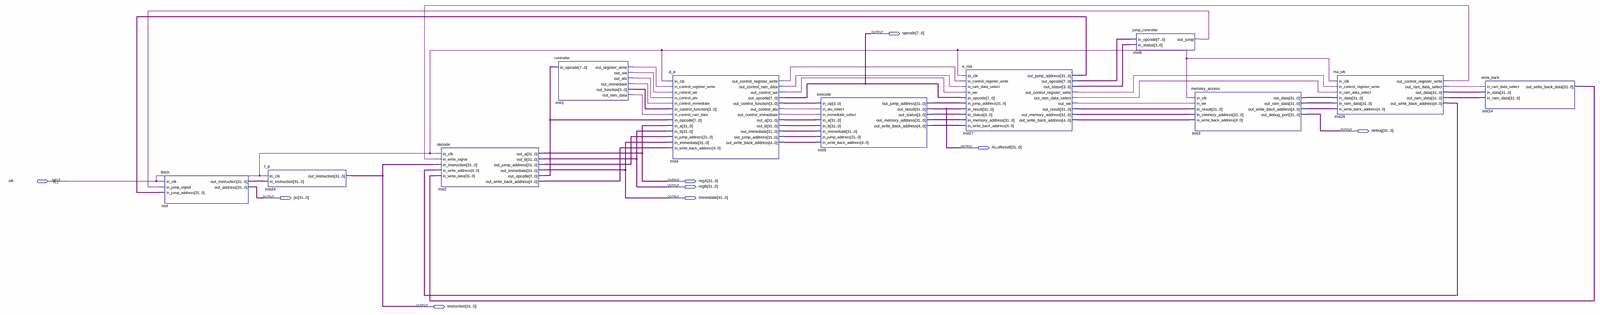
[diagram p0: schematic sheet, whole]
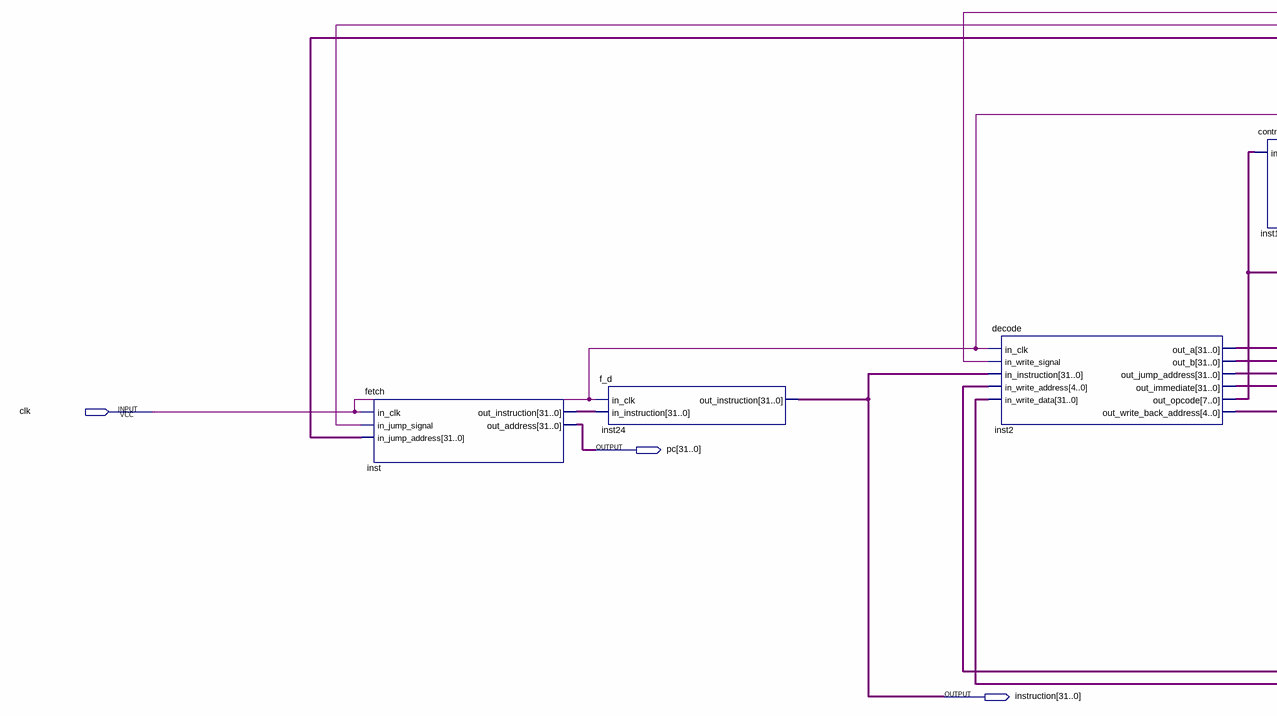
[diagram p1: schematic sheet, left part]
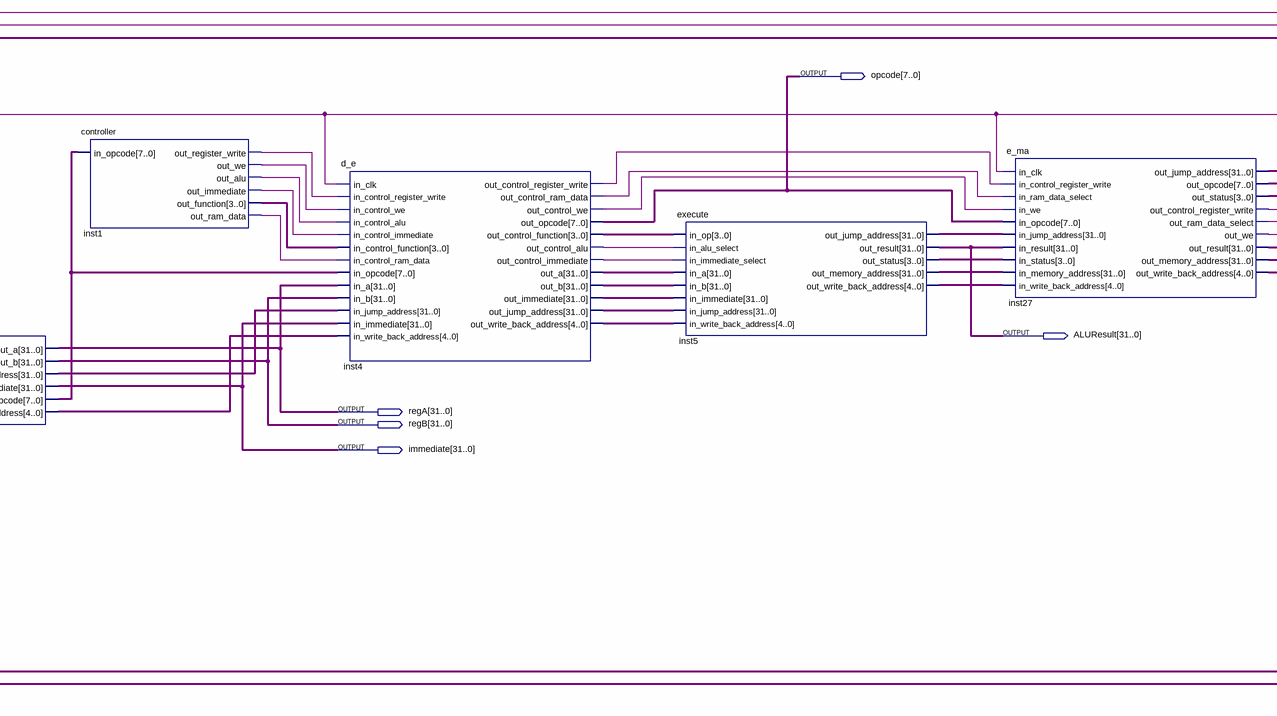
[diagram p2: schematic sheet, centre part]
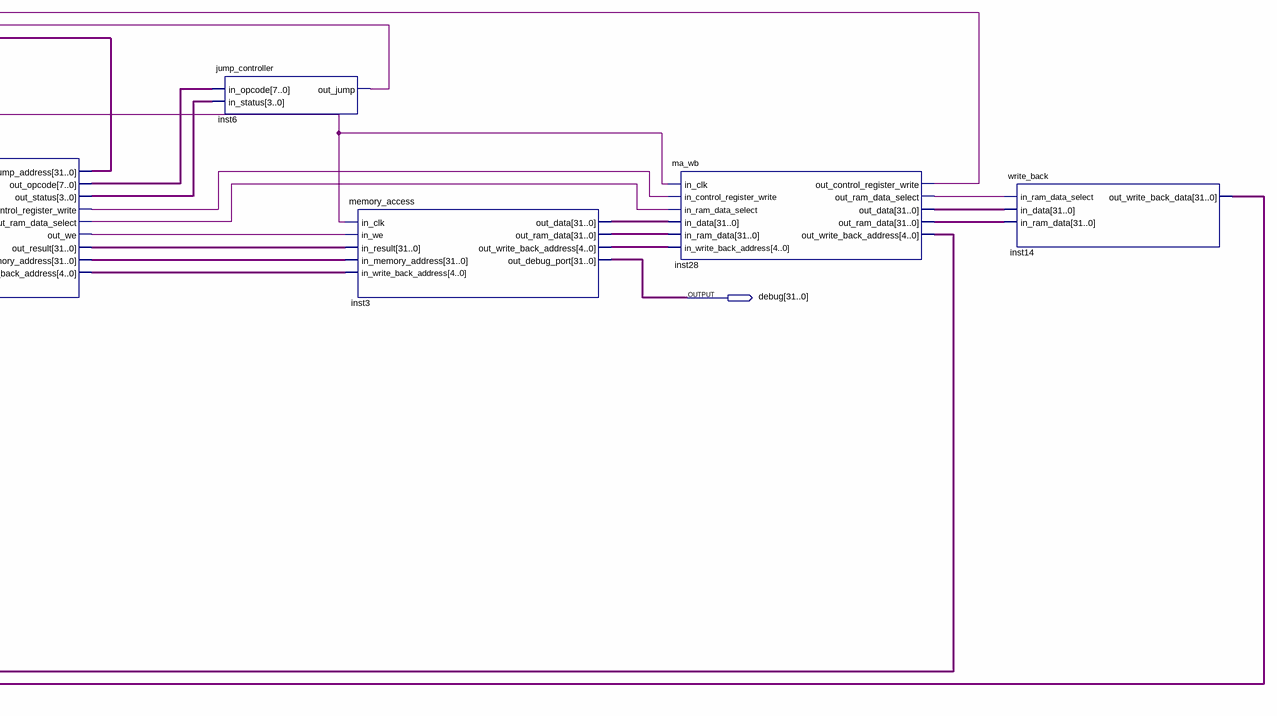
[diagram p3: schematic sheet, right part]
// Quartus schematic Processor.bdf as structural Verilog: 11 symbols, 9 pins
module Processor (
  input  clk,
  output [7:0] opcode,
  output [31:0] debug,
  output [31:0] ALUResult,
  output [31:0] regA,
  output [31:0] regB,
  output [31:0] pc,
  output [31:0] immediate,
  output [31:0] instruction
);

  wire inst1_out_alu, inst1_out_immediate, inst1_out_ram_data, inst1_out_register_write, inst1_out_we,
       inst4_out_control_alu, inst4_out_control_immediate, inst4_out_control_ram_data,
       inst4_out_control_register_write, inst4_out_control_we, inst6_out_jump,
       inst27_out_control_register_write, inst27_out_ram_data_select, inst27_out_we,
       inst28_out_control_register_write, inst28_out_ram_data_select;
  wire [3:0] inst1_out_function, inst4_out_control_function, inst5_out_status, inst27_out_status;
  wire [4:0] inst2_out_write_back_address, inst3_out_write_back_address, inst4_out_write_back_address,
       inst5_out_write_back_address, inst27_out_write_back_address, inst28_out_write_back_address;
  wire [7:0] inst2_out_opcode, inst27_out_opcode;
  wire [31:0] inst2_out_jump_address, inst3_out_data, inst3_out_ram_data, inst4_out_a, inst4_out_b,
       inst4_out_immediate, inst4_out_jump_address, inst5_out_jump_address, inst5_out_memory_address,
       inst14_out_write_back_data, inst27_out_jump_address, inst27_out_memory_address, inst27_out_result,
       inst28_out_data, inst28_out_ram_data, inst_out_instruction;

  fetch inst (
    .in_clk(clk), .in_jump_signal(inst6_out_jump), .in_jump_address(inst27_out_jump_address),
    .out_instruction(inst_out_instruction), .out_address(pc));
  f_d inst24 (.in_clk(clk), .in_instruction(inst_out_instruction), .out_instruction(instruction));
  decode inst2 (
    .in_clk(clk), .in_write_signal(inst28_out_control_register_write), .in_instruction(instruction),
    .in_write_address(inst28_out_write_back_address), .in_write_data(inst14_out_write_back_data),
    .out_a(regA), .out_b(regB), .out_jump_address(inst2_out_jump_address), .out_immediate(immediate),
    .out_opcode(inst2_out_opcode), .out_write_back_address(inst2_out_write_back_address));
  controller inst1 (
    .in_opcode(inst2_out_opcode), .out_register_write(inst1_out_register_write), .out_we(inst1_out_we),
    .out_alu(inst1_out_alu), .out_immediate(inst1_out_immediate), .out_function(inst1_out_function),
    .out_ram_data(inst1_out_ram_data));
  d_e inst4 (
    .in_clk(clk), .in_control_register_write(inst1_out_register_write), .in_control_we(inst1_out_we),
    .in_control_alu(inst1_out_alu), .in_control_immediate(inst1_out_immediate),
    .in_control_function(inst1_out_function), .in_control_ram_data(inst1_out_ram_data),
    .in_opcode(inst2_out_opcode), .in_a(regA), .in_b(regB), .in_jump_address(inst2_out_jump_address),
    .in_immediate(immediate), .in_write_back_address(inst2_out_write_back_address),
    .out_control_register_write(inst4_out_control_register_write),
    .out_control_ram_data(inst4_out_control_ram_data), .out_control_we(inst4_out_control_we),
    .out_opcode(opcode), .out_control_function(inst4_out_control_function),
    .out_control_alu(inst4_out_control_alu), .out_control_immediate(inst4_out_control_immediate),
    .out_a(inst4_out_a), .out_b(inst4_out_b), .out_immediate(inst4_out_immediate),
    .out_jump_address(inst4_out_jump_address), .out_write_back_address(inst4_out_write_back_address));
  execute inst5 (
    .in_op(inst4_out_control_function), .in_alu_select(inst4_out_control_alu),
    .in_immediate_select(inst4_out_control_immediate), .in_a(inst4_out_a), .in_b(inst4_out_b),
    .in_immediate(inst4_out_immediate), .in_jump_address(inst4_out_jump_address),
    .in_write_back_address(inst4_out_write_back_address), .out_jump_address(inst5_out_jump_address),
    .out_result(ALUResult), .out_status(inst5_out_status), .out_memory_address(inst5_out_memory_address),
    .out_write_back_address(inst5_out_write_back_address));
  e_ma inst27 (
    .in_clk(clk), .in_control_register_write(inst4_out_control_register_write),
    .in_ram_data_select(inst4_out_control_ram_data), .in_we(inst4_out_control_we), .in_opcode(opcode),
    .in_jump_address(inst5_out_jump_address), .in_result(ALUResult), .in_status(inst5_out_status),
    .in_memory_address(inst5_out_memory_address), .in_write_back_address(inst5_out_write_back_address),
    .out_jump_address(inst27_out_jump_address), .out_opcode(inst27_out_opcode),
    .out_status(inst27_out_status), .out_control_register_write(inst27_out_control_register_write),
    .out_ram_data_select(inst27_out_ram_data_select), .out_we(inst27_out_we), .out_result(inst27_out_result),
    .out_memory_address(inst27_out_memory_address), .out_write_back_address(inst27_out_write_back_address));
  jump_controller inst6 (.in_opcode(inst27_out_opcode), .in_status(inst27_out_status), .out_jump(inst6_out_jump));
  memory_access inst3 (
    .in_clk(clk), .in_we(inst27_out_we), .in_result(inst27_out_result),
    .in_memory_address(inst27_out_memory_address), .in_write_back_address(inst27_out_write_back_address),
    .out_data(inst3_out_data), .out_ram_data(inst3_out_ram_data),
    .out_write_back_address(inst3_out_write_back_address), .out_debug_port(debug));
  ma_wb inst28 (
    .in_clk(clk), .in_control_register_write(inst27_out_control_register_write),
    .in_ram_data_select(inst27_out_ram_data_select), .in_data(inst3_out_data),
    .in_ram_data(inst3_out_ram_data), .in_write_back_address(inst3_out_write_back_address),
    .out_control_register_write(inst28_out_control_register_write),
    .out_ram_data_select(inst28_out_ram_data_select), .out_data(inst28_out_data),
    .out_ram_data(inst28_out_ram_data), .out_write_back_address(inst28_out_write_back_address));
  write_back inst14 (
    .in_ram_data_select(inst28_out_ram_data_select), .in_data(inst28_out_data),
    .in_ram_data(inst28_out_ram_data), .out_write_back_data(inst14_out_write_back_data));
endmodule
